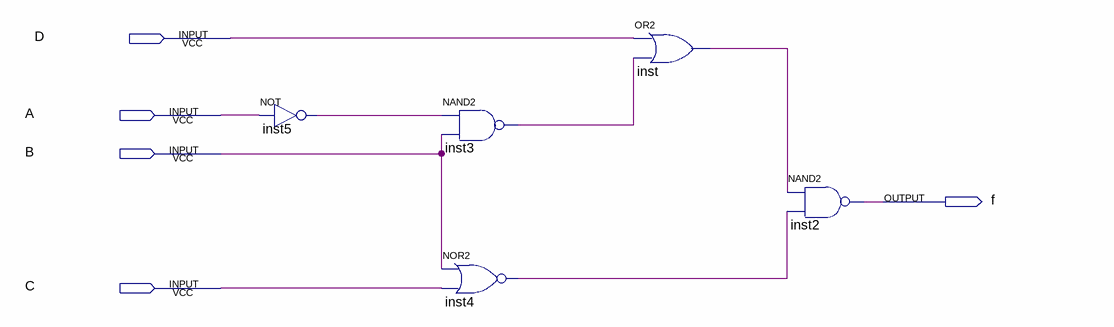
[diagram p0: schematic sheet]
// Quartus schematic Lab1.bdf as structural Verilog: 5 symbols, 5 pins
module Lab1 (
  input  D,
  input  A,
  input  B,
  input  C,
  output f
);

  wire inst3_out, inst4_out, inst5_out, inst_out;

  not inst5 (inst5_out, A);
  nand inst3 (inst3_out, inst5_out, B);
  nor inst4 (inst4_out, B, C);
  or inst (inst_out, D, inst3_out);
  nand inst2 (f, inst_out, inst4_out);
endmodule
